# Altium project SpectrumAnalyer.PrjPcb
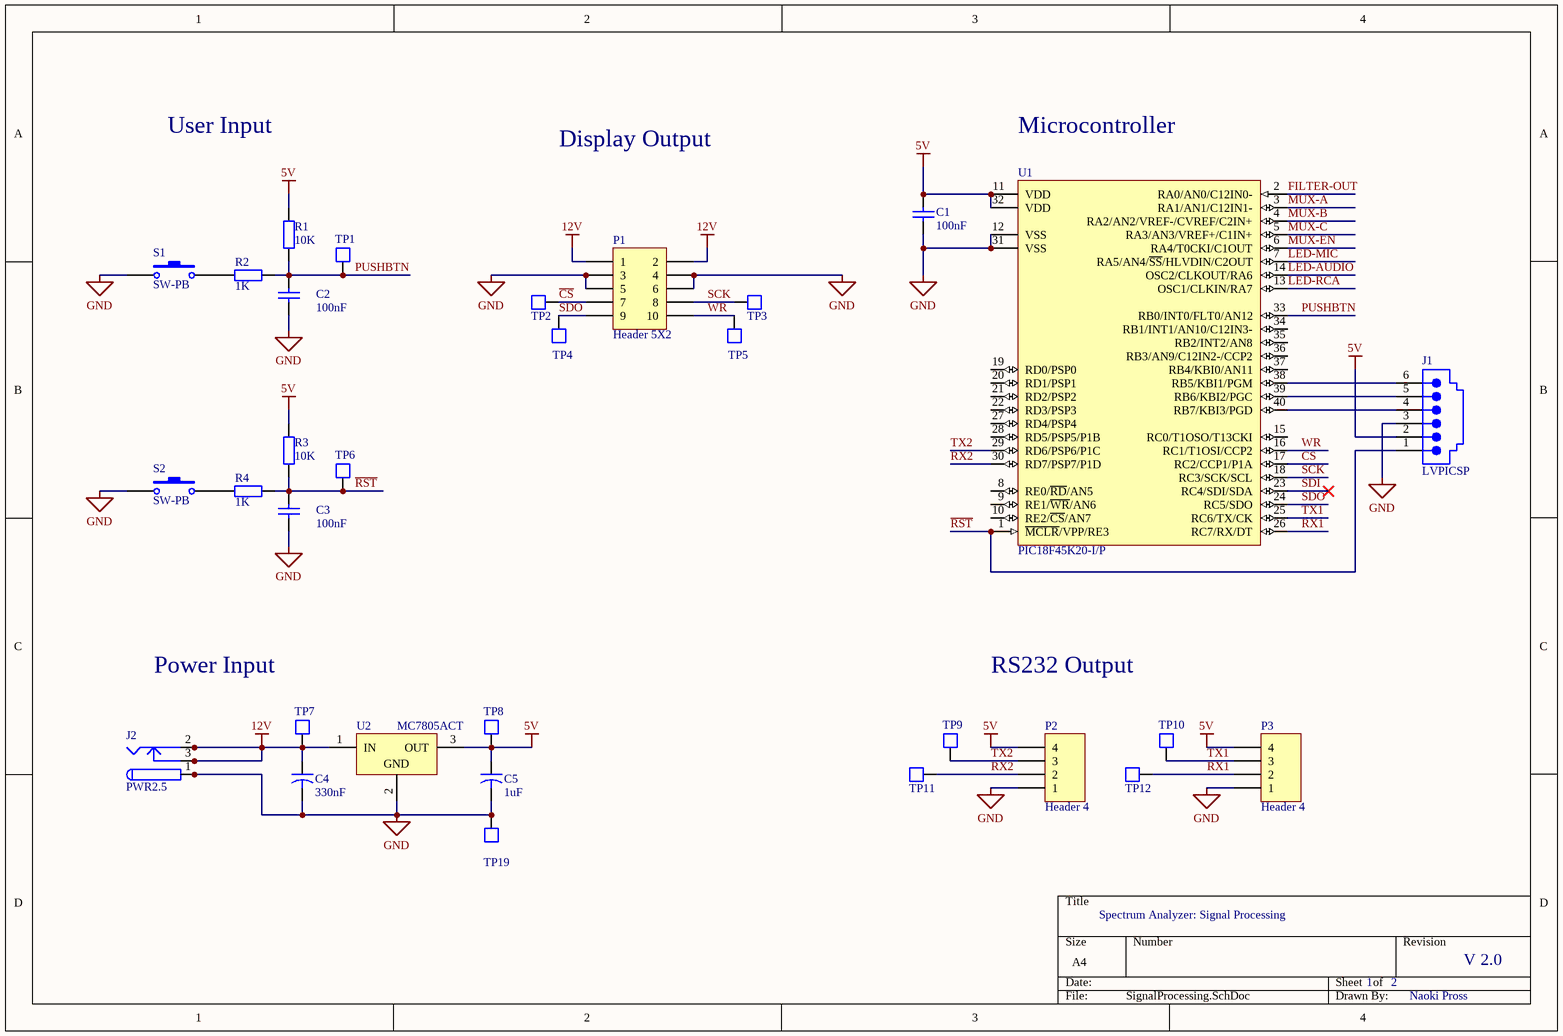
[diagram p0: SignalProcessing.SchDoc]
2 sheets, 68 parts. Net scope: global (net labels, ports and power ports of the same name join across sheets).
Board file: SpectrumAnalyzer.PcbDoc
Sheets:
  SignalProcessing.SchDoc
  SignalAdapter.SchDoc

## Sheet SignalProcessing.SchDoc
size A4; Author: Naoki Pross; CompanyName: SAM Bellinzona; DrawnBy: Naoki Pross; SheetNumber: 1; SheetTotal: 2

### Parts
C1  value 100nF  [RAD-0.1]  (hidden comment: Cap)
C2  value 100nF  [RAD-0.1]  (hidden comment: Cap)
C3  value 100nF  [RAD-0.1]  (hidden comment: Cap)
C4  value 330nF  [CAPR5-4X5]  (hidden comment: Cap2)
C5  value 1uF  [CAPR5-4X5]  (hidden comment: Cap2)
J1  LVPICSP  [95001-2661]
J2  PWR2.5  [KLD-0202]
P1  Header 5X2  [HDR2X5]
P2  Header 4  [HDR1X4]
P3  Header 4  [HDR1X4]
R1  value 10K  [AXIAL-0.4]  (hidden comment: Res2)
R2  value 1K  [AXIAL-0.4]  (hidden comment: Res2)
R3  value 10K  [AXIAL-0.4]  (hidden comment: Res2)
R4  value 1K  [AXIAL-0.4]  (hidden comment: Res2)
S1  SW-PB  [PUSHBTN_12x12mm]
S2  SW-PB  [PUSHBTN_6x6mm]
TP1  Test Pad  [PIN1]  (value not drawn)
TP2  Test Pad  [PIN1]  (value not drawn)
TP3  Test Pad  [PIN1]  (value not drawn)
TP4  Test Pad  [PIN1]  (value not drawn)
TP5  Test Pad  [PIN1]  (value not drawn)
TP6  Test Pad  [PIN1]  (value not drawn)
TP7  Test Pad  [PIN1]  (value not drawn)
TP8  Test Pad  [PIN1]  (value not drawn)
TP9  Test Pad  [PIN1]  (value not drawn)
TP10  Test Pad  [PIN1]  (value not drawn)
TP11  Test Pad  [PIN1]  (value not drawn)
TP12  Test Pad  [PIN1]  (value not drawn)
TP19  Test Pad  [PIN1]  (value not drawn)
U1  PIC18F45K20-I/P  [PDIP600-P40]
U2  MC7805ACT  [221A-04]

### Nets
5V: C1.1 C5.1 J1.2 P2.4 P3.4 R1.2 R3.2 TP8.1 U1.11(VDD) U1.32(VDD) U2.3(OUT)
12V: C4.1 J2.2 J2.2A J2.2B J2.3 J2.3A J2.3B P1.1 P1.2 TP7.1 U2.1(IN)
GND: C1.2 C2.1 C3.1 C4.2 C5.2 J1.3 J2.1 J2.1A J2.1B P1.3 P1.4 P1.5 P1.6 P2.1 P3.1 S1.1 S2.1 TP19.1 U1.12(VSS) U1.31(VSS) U2.2(GND)
~{CS}: P1.7 TP2.1 U1.17(RC2/CCP1/P1A)
FILTER-OUT: U1.2(RA0/AN0/C12IN0-)
LED-AUDIO: U1.14(OSC2/CLKOUT/RA6)
LED-MIC: U1.7(RA5/AN4/~{SS}/HLVDIN/C2OUT)
LED-RCA: U1.13(OSC1/CLKIN/RA7)
MUX-A: U1.3(RA1/AN1/C12IN1-)
MUX-B: U1.4(RA2/AN2/VREF-/CVREF/C2IN+)
MUX-C: U1.5(RA3/AN3/VREF+/C1IN+)
MUX-~{EN}: U1.6(RA4/T0CKI/C1OUT)
PUSHBTN: C2.2 R1.1 R2.2 TP1.1 U1.33(RB0/INT0/FLT0/AN12)
~{RST}: C3.2 J1.1 R3.1 R4.2 TP6.1 U1.1(~{MCLR}/VPP/RE3)
RX1: P3.2 TP12.1 U1.26(RC7/RX/DT)
RX2: P2.2 TP11.1 U1.30(RD7/PSP7/P1D)
SCK: P1.8 TP3.1 U1.18(RC3/SCK/SCL)
SDI: U1.23(RC4/SDI/SDA)
SDO: P1.9 TP4.1 U1.24(RC5/SDO)
TX1: P3.3 TP10.1 U1.25(RC6/TX/CK)
TX2: P2.3 TP9.1 U1.29(RD6/PSP6/P1C)
WR: P1.10 TP5.1 U1.16(RC1/T1OSI/CCP2)
NetJ1_4: J1.4 U1.40(RB7/KBI3/PGD)
NetJ1_5: J1.5 U1.39(RB6/KBI2/PGC)
NetJ1_6: J1.6 U1.38(RB5/KBI1/PGM)
NetR2_1: R2.1 S1.2
NetR4_1: R4.1 S2.2

Not connected (* = marked no-connect by the designer): U1 8(RE0/~{RD}/AN5) 9(RE1/~{WR}/AN6) 10(RE2/~{CS}/AN7) 15(RC0/T1OSO/T13CKI) 19(RD0/PSP0) 20(RD1/PSP1) 21(RD2/PSP2) 22(RD3/PSP3) 27(RD4/PSP4) 28(RD5/PSP5/P1B) 34(RB1/INT1/AN10/C12IN3-) 35(RB2/INT2/AN8) 36(RB3/AN9/C12IN2-/CCP2) 37(RB4/KBI0/AN11)

### Notes on the sheet
- User Input
- Display Output
- Microcontroller
- Power Input
- RS232 Output
- Spectrum Analyzer: Signal Processing
- V 2.0
- Naoki Pross

### Library data of the parts
C1-C3 = Cap: Capacitor; Published: 8-Jun-2000; LatestRevisionDate: 17-Jul-2002; LatestRevisionNote: Re-released for DXP Platform.; PackageReference: RAD-0.3; Publisher: Altium Limited; PackageDescription: Radial Cap, Thru-Hole; 2 Leads; 0.3 in Pin Spacing
C4 C5 = Cap2: Capacitor; Published: 23-Sep-2002; PackageReference: CAPR5-4X5; Publisher: Altium Limited; PackageDescription: Capacitor; 2 Leads
J1 = 95001-2661: Right Angle, Low Profile, Flangeless PCB Jack; Ports: 1; Positions/Loaded: Port1 - 6/6; PerformanceCategory: 3; PCB_Mounting: Thru-Hole; DrillSize: Nominal, Rounded to nearest 0.05mm; PCB_Layout: Complies with Manufacturer's Recommendation.; Published: 25-Jun-2002; DatasheetDocument: 17-Dec-2001; PackageDocument: 17-Dec-2001; PackageReference: 95001-2661; Publisher: Altium Limited; ComponentLink1Description: Manufacturer Link; ComponentLink1URL: http://www.molex.com/; ComponentLink2Description: Datasheet; ComponentLink2URL: http://www.molex.com/cmc_upload/common_files/1222003_mx95001b.pdf; ComponentLink3Description: Iges Model; ComponentLink3URL: http://www.molex.com/pdm_docs/igs/95001-2441_igs.zip
J2 = PWR2.5: Low Voltage Power Supply Connector; Published: 17-Dec-2003; DatasheetDocument: 09-May-2002; Publisher: Altium Limited; ComponentLink1Description: Manufacturer Link; ComponentLink1URL: http://domino.kycon.com/internet/Products.html
P1 = Header 5X2: Header, 5-Pin, Dual row; LatestRevisionDate: 17-Jul-2002; LatestRevisionNote: Re-released for DXP Platform.; Publisher: Altium Limited
P2 P3 = Header 4: Header, 4-Pin; LatestRevisionDate: 17-Jul-2002; LatestRevisionNote: Re-released for DXP Platform.; Publisher: Altium Limited
R1-R4 = Res2: Resistor; Published: 8-Jun-2000; LatestRevisionDate: 17-Jul-2002; LatestRevisionNote: Re-released for DXP Platform.; PackageReference: AXIAL-0.4; Publisher: Altium Limited; PackageDescription: Axial Device, Thru-Hole; 2 Leads; 0.4 in Pin Spacing
S1 S2 = SW-PB: Switch; Published: 24-Mar-1999; LatestRevisionDate: 17-Jul-2002; LatestRevisionNote: Re-released for DXP Platform.; PackageReference: SPST-2; Publisher: Altium Limited; PackageDescription: Switch; 2 Leads
TP1-TP12 TP19 = TestPad
U1 = PIC18F45K20-I/P: Flash Microcontroller with 10-Bit A/D and nanoWatt Technology, 32K Flash, 40-Pin PDIP, Industrial Temperature Range; Published: 29-Jan-2009; LatestRevisionDate: 02-Dec-2009; LatestRevisionNote: Updated to datasheet revision F, Sep-2009; DatasheetVersion: revF, Sep-2009; PackageVersion: revBB, Aug-2009; PackageReference: PDIP600-P40; Publisher: Altium Limited; PackageDescription: 40-Lead Plastic Dual In-Line (P) - 600 mil Body [PDIP]; Supplier 1: Digi-Key; Supplier Part Number 1: PIC18F45K20-I/P-ND; Supplier 2: Farnell; Supplier Part Number 2: 1439588; ComponentLink1Description: Datasheet; ComponentLink1URL: http://ww1.microchip.com/downloads/en/DeviceDoc/41303F.pdf; ComponentLink2Description: Packaging Specification; ComponentLink2URL: http://www.microchip.com/stellent/groups/techpub_sg/documents/packagingspec/en012702.pdf; ComponentLink3Description: Microchip.com Home; ComponentLink3URL: http://www.microchip.com/
U2 = MC7805ACT: 3-Terminal Positive Fixed Voltage Regulator; Note: Pin 2 is electrically connected to TAB; Published: 17-Jul-2002; DatasheetVersion: 1988; PackageReference: 221A-04; Publisher: Altium Limited; PackageDescription: TO, Thru-Hole, Vertical, Heatsink Mounted; 3 In-Line Leads; Pitch 2.54 mm; Code_JEDEC: TO-262-AA; ComponentLink1Description: Manufacturer Link; ComponentLink1URL: http://www.onsemi.com/site/products/taxonomy/0,4438,503,00.html; ComponentLink2Description: Datasheet; ComponentLink2URL: http://www.onsemi.com/pub/Collateral/MC7800-D.PDF

## Sheet SignalAdapter.SchDoc
size A4; SheetNumber: 2; SheetTotal: 2
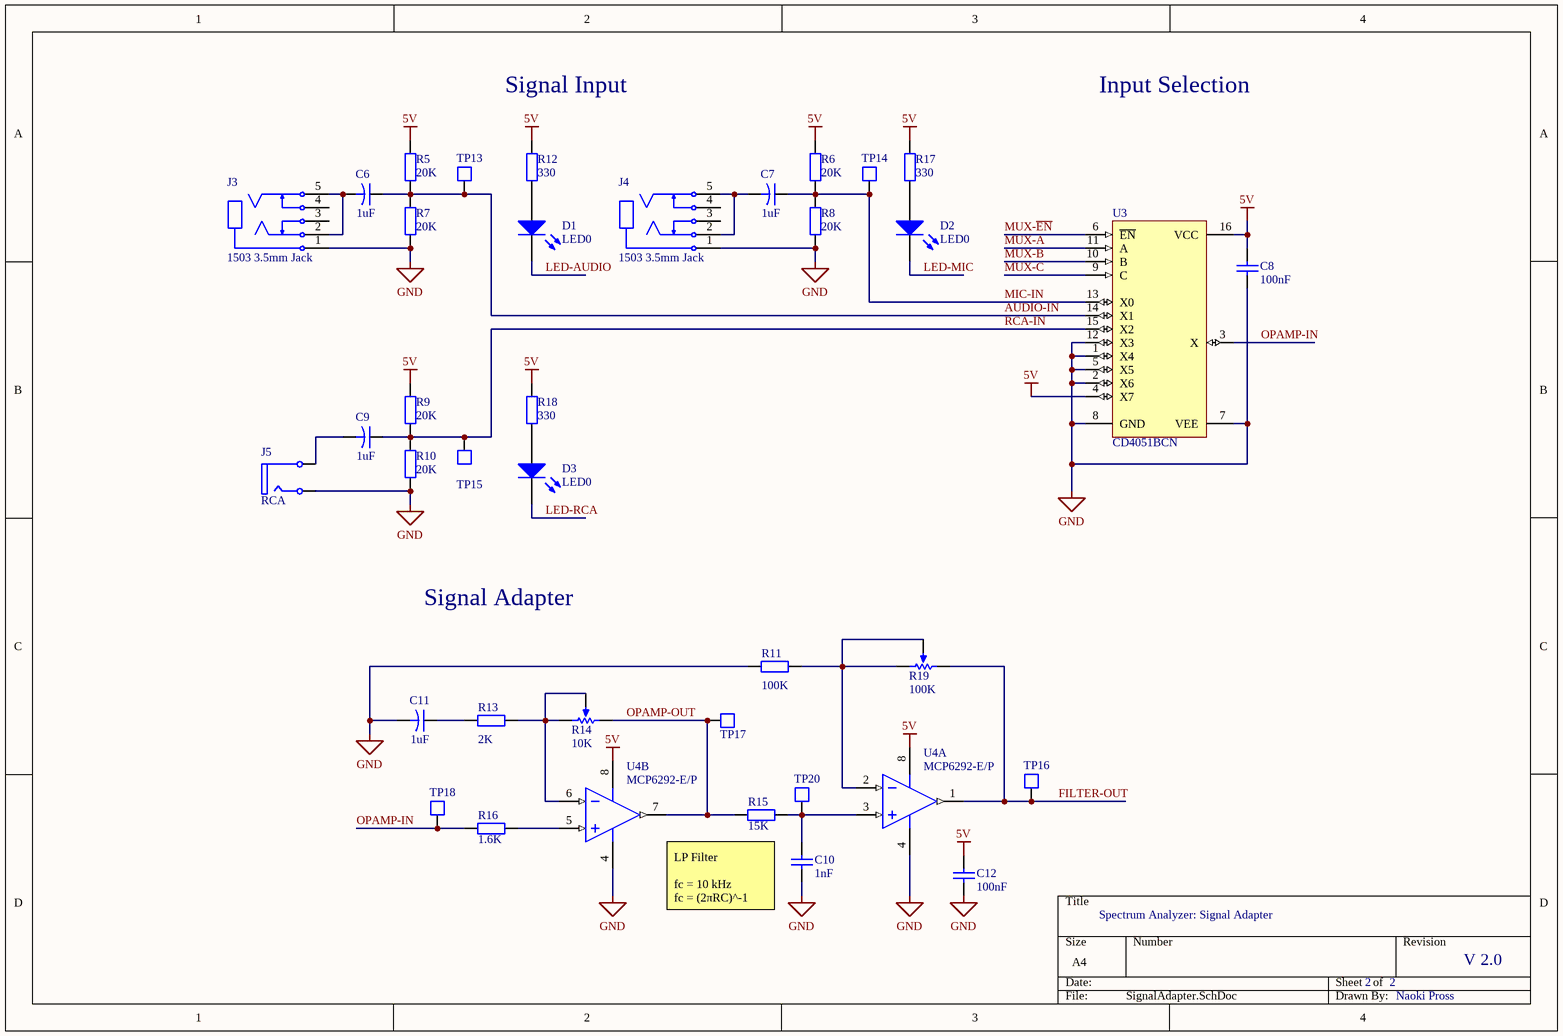
[diagram p1: SignalAdapter.SchDoc]

### Parts
C6  value 1uF  [CAPR5-4X5]  (hidden comment: Cap2)
C7  value 1uF  [CAPR5-4X5]  (hidden comment: Cap2)
C8  value 100nF  [RAD-0.1]  (hidden comment: Cap)
C9  value 1uF  [CAPR5-4X5]  (hidden comment: Cap2)
C10  value 1nF  [RAD-0.1]  (hidden comment: Cap)
C11  value 1uF  [CAPR5-4X5]  (hidden comment: Cap2)
C12  value 100nF  [RAD-0.1]  (hidden comment: Cap)
D1  LED0  [LED-0]
D2  LED0  [LED-0]
D3  LED0  [LED-0]
J3  1503 3.5mm Jack  [JIS C 6560]
J4  1503 3.5mm Jack  [JIS C 6560]
J5  RCA  [RC-5231]
R5  value 20K  [AXIAL-0.4]  (hidden comment: Res2)
R6  value 20K  [AXIAL-0.4]  (hidden comment: Res2)
R7  value 20K  [AXIAL-0.4]  (hidden comment: Res2)
R8  value 20K  [AXIAL-0.4]  (hidden comment: Res2)
R9  value 20K  [AXIAL-0.4]  (hidden comment: Res2)
R10  value 20K  [AXIAL-0.4]  (hidden comment: Res2)
R11  value 100K  [AXIAL-0.4]  (hidden comment: Res2)
R12  value 330  [AXIAL-0.4]  (hidden comment: Res2)
R13  value 2K  [AXIAL-0.4]  (hidden comment: Res2)
R14  value 10K  [VR4]  (hidden comment: RPot)
R15  value 15K  [AXIAL-0.4]  (hidden comment: Res2)
R16  value 1.6K  [AXIAL-0.4]  (hidden comment: Res2)
R17  value 330  [AXIAL-0.4]  (hidden comment: Res2)
R18  value 330  [AXIAL-0.4]  (hidden comment: Res2)
R19  value 100K  [VR4]  (hidden comment: RPot)
TP13  Test Pad  [PIN1]  (value not drawn)
TP14  Test Pad  [PIN1]  (value not drawn)
TP15  Test Pad  [PIN1]  (value not drawn)
TP16  Test Pad  [PIN1]  (value not drawn)
TP17  Test Pad  [PIN1]  (value not drawn)
TP18  Test Pad  [PIN1]  (value not drawn)
TP20  Test Pad  [PIN1]  (value not drawn)
U3  CD4051BCN  [N16E]
U4  MCP6292-E/P  [PDIP300-P8]  (parts A,B of 2)

### Nets
5V: C8.1 C12.1 R5.2 R6.2 R9.2 R12.2 R17.2 R18.2 U3.4(X7) U3.16(VCC) U4.8(VDD)
GND: C8.2 C10.1 C11.2 C12.2 J3.1 J4.1 J5.2B(Signal) R7.1 R8.1 R10.1 R11.1 U3.1(X4) U3.2(X6) U3.5(X5) U3.7(VEE) U3.8(GND) U3.12(X3) U4.4(VSS)
AUDIO-IN: C6.1 R5.1 R7.2 TP13.1 U3.14(X1)
FILTER-OUT: R19.1(TOP) TP16.1 U4.1(VOUTA)
LED-AUDIO: D1.2(K)
LED-MIC: D2.2(K)
LED-RCA: D3.2(K)
MIC-IN: C7.1 R6.1 R8.2 TP14.1 U3.13(X0)
MUX-A: U3.11(A)
MUX-B: U3.10(B)
MUX-C: U3.9(C)
MUX-~{EN}: U3.6(~{EN})
OPAMP-IN: R16.2 TP18.1 U3.3(X)
OPAMP-OUT: R14.1(TOP) R15.2 TP17.1 U4.7(VOUTB)
RCA-IN: C9.1 R9.1 R10.2 TP15.1 U3.15(X2)
NetC6_2: C6.2 J3.2 J3.5
NetC7_2: C7.2 J4.2 J4.5
NetC9_2: C9.2 J5.1A(Ground)
NetC10_2: C10.2 R15.1 TP20.1 U4.3(VINA+)
NetC11_1: C11.1 R13.1
NetD1_1: D1.1(A) R12.1
NetD2_1: D2.1(A) R17.1
NetD3_1: D3.1(A) R18.1
NetR11_2: R11.2 R19.2(BOT) R19.3(TAP) U4.2(VINA-)
NetR13_2: R13.2 R14.2(BOT) R14.3(TAP) U4.6(VINB-)
NetR16_1: R16.1 U4.5(VINB+)

Not connected (* = marked no-connect by the designer): J3 3 4; J4 3 4

### Notes on the sheet
- Signal Input
- Input Selection
- Signal Adapter
- LP Filter
  fc = 10 kHz
  fc = (2πRC)^-1
- Spectrum Analyzer: Signal Adapter
- V 2.0
- Naoki Pross

### Library data of the parts
C6 C7 C9 C11 = Cap2: Capacitor; Published: 23-Sep-2002; PackageReference: CAPR5-4X5; Publisher: Altium Limited; PackageDescription: Capacitor; 2 Leads
C8 C10 C12 = Cap: Capacitor; Published: 8-Jun-2000; LatestRevisionDate: 17-Jul-2002; LatestRevisionNote: Re-released for DXP Platform.; PackageReference: RAD-0.3; Publisher: Altium Limited; PackageDescription: Radial Cap, Thru-Hole; 2 Leads; 0.3 in Pin Spacing
D1-D3 = LED0: Typical INFRARED GaAs LED; Published: 8-Jun-2000; LatestRevisionDate: 08-Jul-2005; LatestRevisionNote: Mech Layer 1 removed.; PackageReference: LED-0; Publisher: Altium Limited; PackageDescription: LED; 2 Leads
J3 J4 = 1503: 1503 09/17 Jack connector
J5 = RCA: RCA Phono Jack, Right Angle, Thru-Hole, Snap-In; pin to pad: 1A>4 2B>1; PCB_Layout: Complies with manufacturer's recommendation.; DrillAndSlotSize: Corresponds to nominal value.; Published: 15-Jul-2004; LatestRevisionDate: 15-Jul-2004; LatestRevisionNote: Component Replaced.; DatasheetDocument: 7-Jul-2000; PackageDocument: 7-Jul-2000; PackageReference: 161; Publisher: Altium Limited; ComponentLink1Description: Manufacturer Link; ComponentLink1URL: http://www.mouser.com/kobiconn/
R5-R13 R15-R18 = Res2: Resistor; Published: 8-Jun-2000; LatestRevisionDate: 17-Jul-2002; LatestRevisionNote: Re-released for DXP Platform.; PackageReference: AXIAL-0.4; Publisher: Altium Limited; PackageDescription: Axial Device, Thru-Hole; 2 Leads; 0.4 in Pin Spacing
R14 R19 = RPot: Potentiometer; Sim Note: Enter the Resistance value and the set point into parameter fields.; Set Position: 0.5; Published: 8-Jun-2000; LatestRevisionDate: 17-Jul-2002; LatestRevisionNote: Re-released for DXP Platform.; PackageReference: VR5; Publisher: Altium Limited; PackageDescription: Variable Resistor, Thru-Hole; 3 Leads
TP13-TP18 TP20 = TestPad
U3 = CD4051BCN: 8-Channel Analog Multiplexer/Demultiplexer; Published: 17-Jul-2002; LatestRevisionDate: 29-May-2009; LatestRevisionNote: Component Body Added.; DatasheetVersion: Jan-1999; PackageVersion: 2000; PackageReference: N16E; Publisher: Altium Limited; PackageDescription: DIP, 16-Pin, Row Spacing 7.62 mm, Pitch 2.54 mm; ComponentLink1Description: Manufacturer Link; ComponentLink1URL: http://www.fairchildsemi.com/; ComponentLink2Description: Datasheet; ComponentLink2URL: http://www.fairchildsemi.com/ds/CD%2FCD4052BC.pdf
U4 = MCP6292-E/P: 1.0 mA, 10 MHz Rail-to-Rail Operational Amplifier, 8-Pin PDIP, Extended Temperature; Published: 29-Jan-2009; DatasheetVersion: revE, Nov-2007; PackageVersion: revBB, Aug-2009; PackageReference: PDIP300-P8; Publisher: Altium Limited; PackageDescription: 8-Lead Plastic Dual In-Line (P) - 300 mil Body [PDIP]; Supplier 1: Digi-Key; Supplier Part Number 1: MCP6292-E/P-ND; Supplier 2: Farnell; Supplier Part Number 2: 1439466; Code_JEDEC: MS-001; ComponentLink1Description: Datasheet; ComponentLink1URL: http://ww1.microchip.com/downloads/en/DeviceDoc/21812e.pdf; ComponentLink2Description: Packaging Specification; ComponentLink2URL: http://www.microchip.com/stellent/groups/techpub_sg/documents/packagingspec/en012702.pdf; ComponentLink3Description: Microchip.com Home; ComponentLink3URL: http://www.microchip.com/

## Nets that join several sheets
5V: SignalProcessing (11 pins), SignalAdapter (11 pins)
GND: SignalProcessing (21 pins), SignalAdapter (18 pins)
FILTER-OUT: SignalProcessing (U1.2), SignalAdapter (R19.1 TP16.1 U4.1)
LED-AUDIO: SignalProcessing (U1.14), SignalAdapter (D1.2)
LED-MIC: SignalProcessing (U1.7), SignalAdapter (D2.2)
LED-RCA: SignalProcessing (U1.13), SignalAdapter (D3.2)
MUX-A: SignalProcessing (U1.3), SignalAdapter (U3.11)
MUX-B: SignalProcessing (U1.4), SignalAdapter (U3.10)
MUX-C: SignalProcessing (U1.5), SignalAdapter (U3.9)
MUX-~{EN}: SignalProcessing (U1.6), SignalAdapter (U3.6)